# EAGLE design modem (EAGLE 6.6.0)
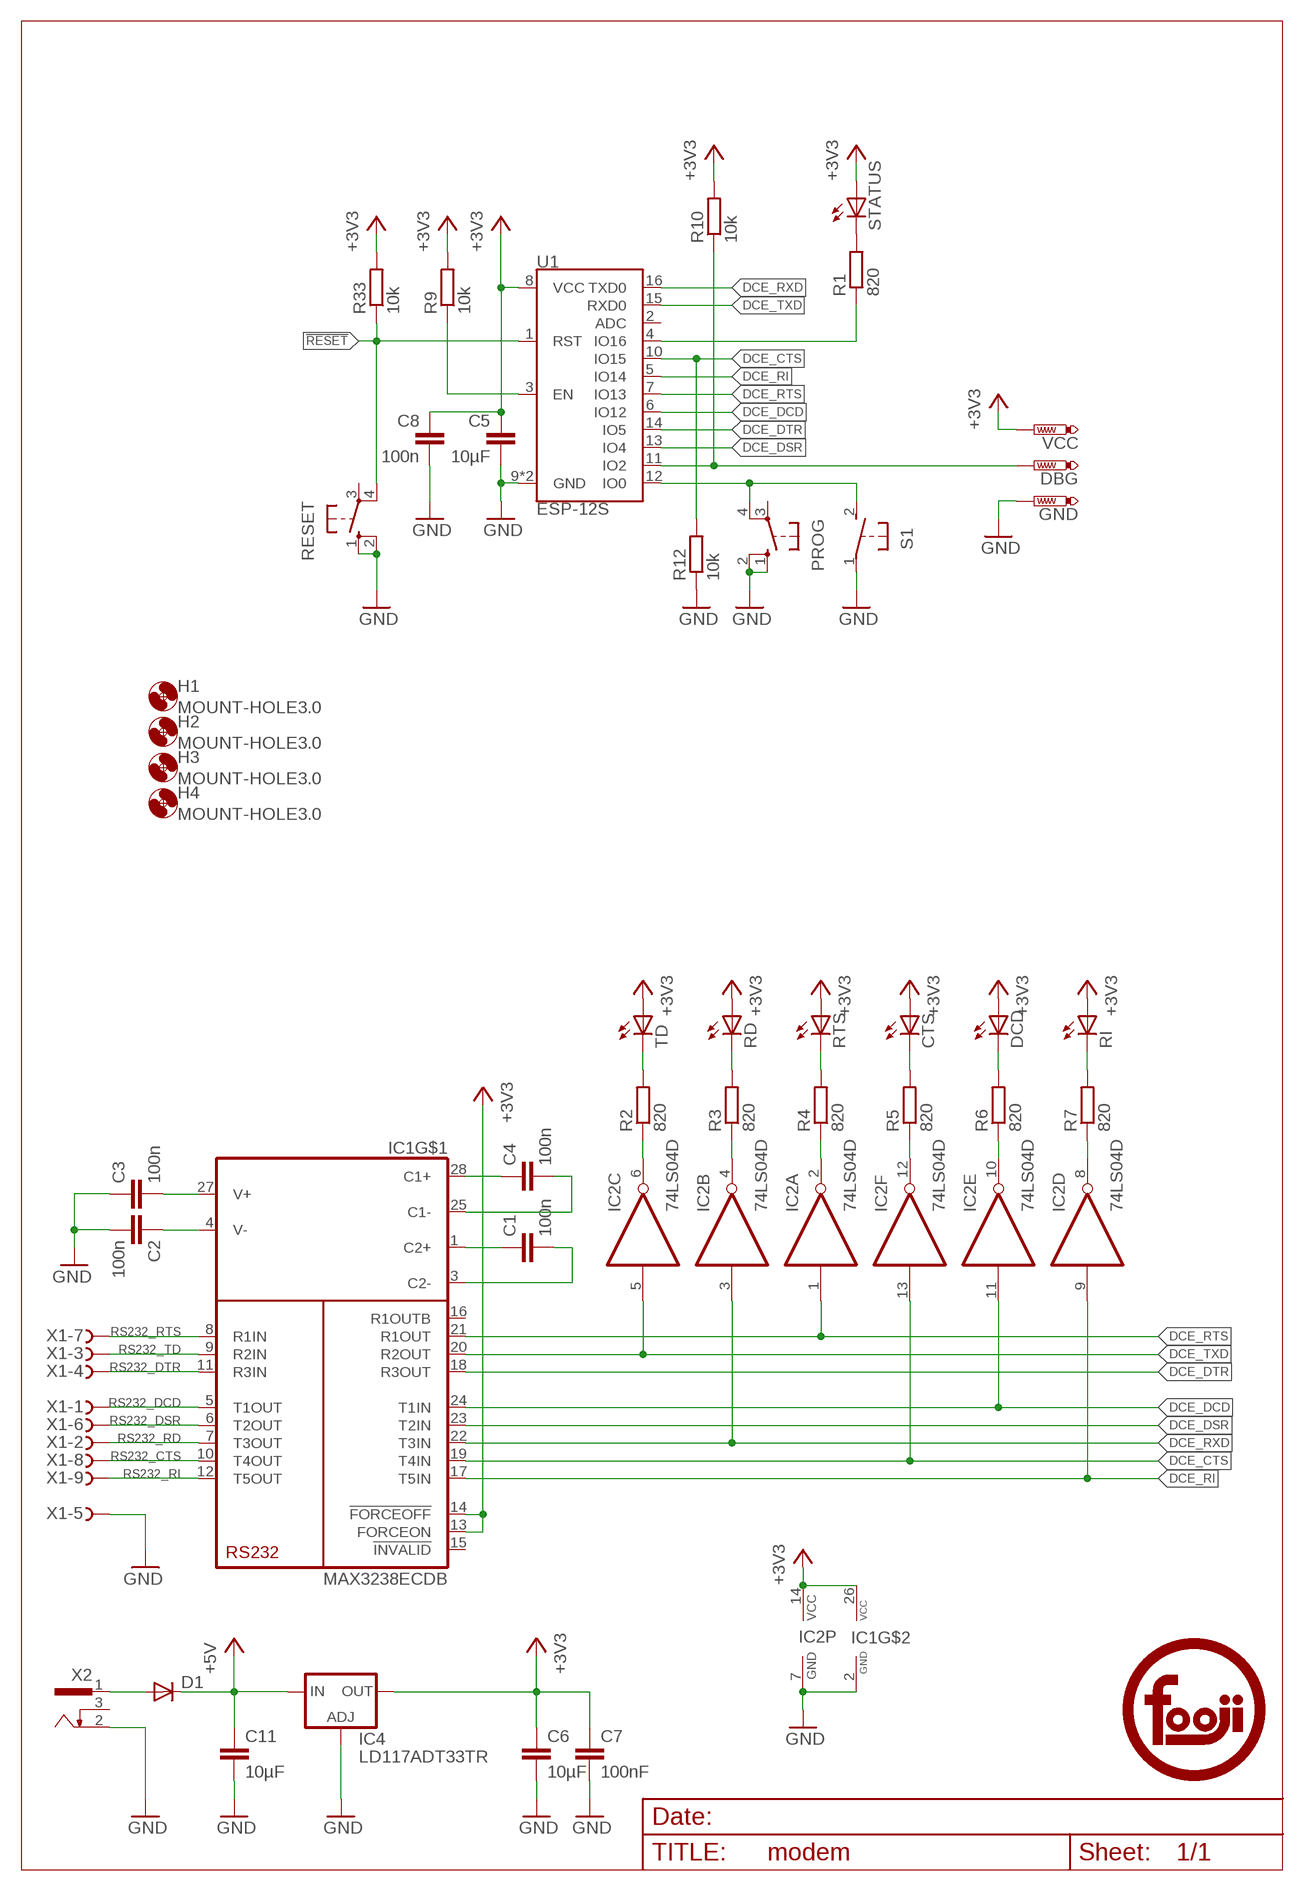
[diagram p0: schematic, sheet 1]

## Parts
C1  100n  C-EUC0805  [C0805]
C2  100n  C-EUC0805  [C0805]
C3  100n  C-EUC0805  [C0805]
C4  100n  C-EUC0805  [C0805]
C5  10µF  C-EUC0805  [C0805]
C6  10µF  C-EUC0805  [C0805]
C7  100nF  C-EUC0805  [C0805]
C8  100n  C-EUC0805  [C0805]
C11  10µF  C-EUC0805  [C0805]
CTS  LED5MM  [LED5MM]
D1  DIODE-SMB  [SMB]
DBG  PTR1PAD1-13  [P1-13]
DCD  LED5MM  [LED5MM]
GND  PTR1PAD1-13  [P1-13]
H1  MOUNT-HOLE3.0  [3,0]
H2  MOUNT-HOLE3.0  [3,0]
H3  MOUNT-HOLE3.0  [3,0]
H4  MOUNT-HOLE3.0  [3,0]
IC1  MAX3238ECDB  [SSOP28]
IC2  74LS04D  [SO14]
IC4  LD117ADT33TR  [DPACK]
PROG  10-XX  [B3F-10XX]
R1  820  R-EU_R0805  [R0805]
R2  820  R-EU_R0805  [R0805]
R3  820  R-EU_R0805  [R0805]
R4  820  R-EU_R0805  [R0805]
R5  820  R-EU_R0805  [R0805]
R6  820  R-EU_R0805  [R0805]
R7  820  R-EU_R0805  [R0805]
R9  10k  R-EU_R0805  [R0805]
R10  10k  R-EU_R0805  [R0805]
R12  10k  R-EU_R0805  [R0805]
R33  10k  R-EU_R0805  [R0805]
RD  LED5MM  [LED5MM]
RESET  10-XX  [B3F-10XX]
RI  LED5MM  [LED5MM]
RTS  LED5MM  [LED5MM]
S1  31-XX  [B3F-31XX]
STATUS  LED5MM  [LED5MM]
TD  LED5MM  [LED5MM]
U1  ESP-12S  [ESP-12S]
U$3  LOGOTOP_NOCIRCLE_TSTOP  [LOGO_TOP_NOCIRCLE_TSTOP]
VCC  PTR1PAD1-13  [P1-13]
X1  F09HPS  [F09HP]
X2  733980-62  [733980-62]

## Nets
!RESET: R33.1 RESET.4(P1) U1.1(RST)
+3V3: C5.1 C6.1 C7.1 C8.1 CTS.A DCD.A IC1.13(FORCEON) IC1.14(!FORCEOFF) IC1.26(VCC) IC2.14(P:VCC) IC4.4(OUT) R9.2 R10.2 R33.2 RD.A RI.A RTS.A STATUS.A TD.A U1.8(VCC) VCC.TP
+5V: C11.1 D1.C IC4.3(IN)
DCE_CTS: IC1.19(T4IN) IC2.13(F:I) R12.2 U1.10(IO15)
DCE_DCD: IC1.24(T1IN) IC2.11(E:I) U1.6(IO12)
DCE_DSR: IC1.23(T2IN) U1.13(IO4)
DCE_DTR: IC1.18(R3OUT) U1.14(IO5)
DCE_RI: IC1.17(T5IN) IC2.9(D:I) U1.5(IO14)
DCE_RTS: IC1.21(R1OUT) IC2.1(A:I) U1.7(IO13)
DCE_RXD: IC1.22(T3IN) IC2.3(B:I) U1.16(TXD0)
DCE_TXD: IC1.20(R2OUT) IC2.5(C:I) U1.15(RXD0)
DEBUG: DBG.TP R10.1 U1.11(IO2)
GND: C2.2 C3.1 C5.2 C6.2 C7.2 C8.2 C11.2 GND.TP IC1.2(GND) IC2.7(P:GND) IC4.1(ADJ) PROG.1(S) PROG.2(S1) R12.1 RESET.1(S) RESET.2(S1) S1.1(P) U1.9(GND) U1.P$1(GND) X1.5(-5:F) X2.2
N$1: R1.2 STATUS.K(C)
N$2: IC2.6(C:O) R2.1
N$3: R9.1 U1.3(EN)
N$4: D1.A X2.1
N$5: R2.2 TD.K(C)
N$6: R3.2 RD.K(C)
N$7: IC2.4(B:O) R3.1
N$8: IC2.2(A:O) R4.1
N$9: IC2.12(F:O) R5.1
N$10: CTS.K(C) R5.2
N$11: C2.1 IC1.4(V-)
N$12: C3.2 IC1.27(V+)
N$13: C1.1 IC1.1(C2+)
N$14: C1.2 IC1.3(C2-)
N$15: C4.2 IC1.25(C1-)
N$16: C4.1 IC1.28(C1+)
N$17: DCD.K(C) R6.2
N$18: R7.2 RI.K(C)
N$19: IC2.8(D:O) R7.1
N$20: IC2.10(E:O) R6.1
N$21: R4.2 RTS.K(C)
N$23: PROG.4(P1) S1.2(S) U1.12(IO0)
RS232_CTS: IC1.10(T4OUT) X1.8(-8:F)
RS232_DCD: IC1.5(T1OUT) X1.1(-1:F)
RS232_DSR: IC1.6(T2OUT) X1.6(-6:F)
RS232_DTR: IC1.11(R3IN) X1.4(-4:F)
RS232_RD: IC1.7(T3OUT) X1.2(-2:F)
RS232_RI: IC1.12(T5OUT) X1.9(-9:F)
RS232_RTS: IC1.8(R1IN) X1.7(-7:F)
RS232_TD: IC1.9(R2IN) X1.3(-3:F)
STATUS_A: R1.1 U1.4(IO16)
Unconnected: IC1.15(!INVALID) IC1.16(R1OUTB) PROG.3(P) RESET.3(P) U1.2(ADC) X1.G1(-G:G1) X1.G2(-G:G2) X2.3

## Library data of the parts
C1-C8 C11 = rcl:C-EU: CAPACITOR, European symbol
CTS DCD RD RI RTS STATUS TD = led:LED: LED OSRAM: - CHIPLED LG R971, LG N971, LY N971, LG Q971, LY Q971, LO R971, LY R971 LH N974, LH R974 LS Q976, LO Q976, LY Q976 LO Q996 - Hyper CHIPLED LW Q18S LB Q993, LB Q99A, LB R99A - SideLED LS A670, LO A670, LY A670, LG A670, LP A670 LB A673, LV A673, LT A673, LW A673 LH A674 LY A675 LS A676, LA A676, LO A676, LY A676, LW A676 LS A679, LY A679, LG A679 - Hyper Micro SIDELED® LS Y876, LA Y876, LO Y876, LY Y876 LT Y87S - SmartLED LW L88C, LW L88S LB L89C, LB L89S, LG L890 LS L89K, LO L89K, LY L89K LS L896, LA L896, LO L896, LY L896 - TOPLED LS T670, LO T670, LY T670, LG T670, LP T670 LSG T670, LSP T670, LSY T670, LOP T670, LYG T670 LG T671, LOG T671, LSG T671 LB T673, LV T673, LT T673, LW T673 LH T674 LS T676, LA T676, LO T676, LY T676, LB T676, LH T676, LSB T676, LW T676 LB T67C, LV T67C, LT T67C, LS T67K, LO T67K, LY T67K, LW E67C LS E67B, LA E67B, LO E67B, LY E67B, LB E67C, LV E67C, LT E67C LW T67C LS T679, LY T679, LG T679 LS T770, LO T770, LY T770, LG T770, LP T770 LB T773, LV T773, LT T773, LW T773 LH T774 LS E675, LA E675, LY E675, LS T675 LS T776, LA T776, LO T776, LY T776, LB T776 LHGB T686 LT T68C, LB T68C - Hyper Mini TOPLED® LB M676 - Mini TOPLED Santana® LG M470 LS M47K, LO M47K, LY M47K Source: http://www.osram.convergy.de LUXEON: - LUMILED® LXK2-PW12-R00, LXK2-PW12-S00, LXK2-PW14-U00, LXK2-PW14-V00 LXK2-PM12-R00, LXK2-PM12-S00, LXK2-PM14-U00 LXK2-PE12-Q00, LXK2-PE12-R00, LXK2-PE12-S00, LXK2-PE14-T00, LXK2-PE14-U00 LXK2-PB12-K00, LXK2-PB12-L00, LXK2-PB12-M00, LXK2-PB14-N00, LXK2-PB14-P00, LXK2-PB14-Q00 LXK2-PR12-L00, LXK2-PR12-M00, LXK2-PR14-Q00, LXK2-PR14-R00 LXK2-PD12-Q00, LXK2-PD12-R00, LXK2-PD12-S00 LXK2-PH12-R00, LXK2-PH12-S00 LXK2-PL12-P00, LXK2-PL12-Q00, LXK2-PL12-R00 Source: www.luxeon.com KINGBRIGHT: KA-3528ASYC Source: www.kingbright.com
D1 = diode:DIODE-: DIODE
DBG GND VCC = testpad:PTR1: TEST PIN
H1-H4 = holes:MOUNT-HOLE: MOUNTING HOLE with drill center marker
IC1 = modem:MAX3238E
IC2 = 74xx-eu:74*04: Hex INVERTER
IC4 = v-reg:LD117A?*: Low drop fixed and adjustable positive voltage regulators 1 A Source: http://www.st.com/stonline/products/literature/ds/7194/ld1117axx.pdf
PROG RESET = switch-omron:10-XX: OMRON SWITCH; MPN: B3F-1000; OC_FARNELL: 176432; OC_NEWARK: 36M3542
R1-R7 R9 R10 R12 R33 = rcl:R-EU_: RESISTOR, European symbol
S1 = switch-omron:31-XX: OMRON SWITCH; MPN: B3F-3100; OC_FARNELL: 959704; OC_NEWARK: 36M3582
U1 = modem:ESP-12S: AI-Thinker ESP-12S ESP-12S WiFi module is developed by AI-Thinker Co.,Ltd, core processor ESP8266 in smaller sizes of the module encapsulates Tensilica L106 integrates industry-leading ultra low power 32-bit MCU micro, with the 16-bit short mode, clock speed support 80 MHz, 160 MHz, supports the RTOS, integrated Wi-Fi MAC/BB/RF/PA/LNA, on-board antennas.; PROD_ID: IC-14115
U$3 = fooji:LOGO
X1 = con-subd:F09HPS: SUB-D; OC_FARNELL: unknown; OC_NEWARK: unknown
X2 = con-conrad:73398?: FEMALE PRINT CONNECTOR Niedervolt-Steckverbinder Distributor Conrad

## Board
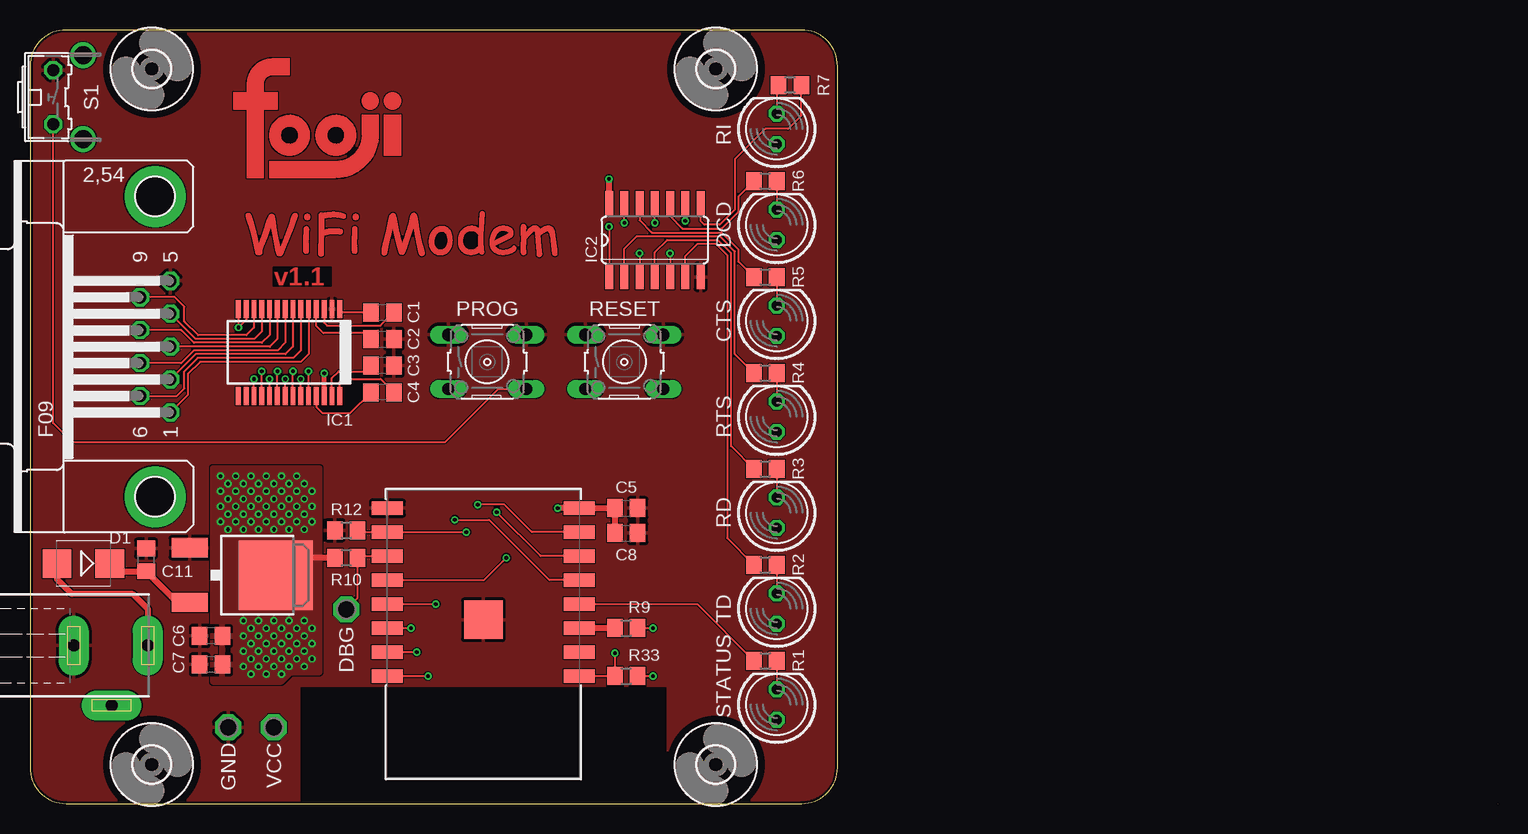
[diagram p1: board, top side]
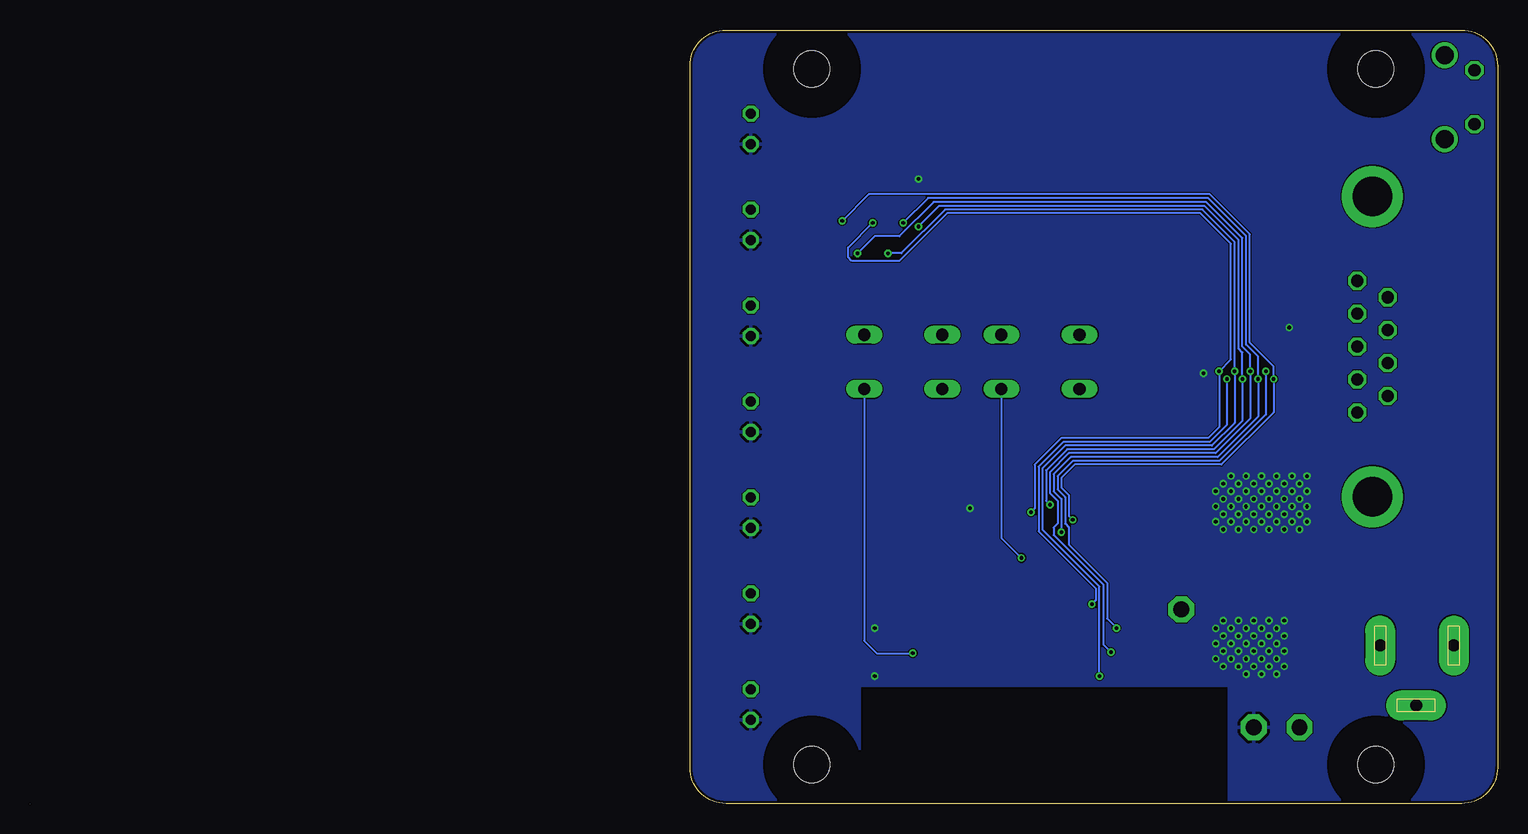
[diagram p2: board, bottom side, seen from below]

Size 122.3 x 64.5 mm. Coordinates in mm from the lower left corner, seen from the top.
Outline: 122.3,0 122.3,0
Outline: 0,61.5 0,3 arc90 3,0 64.3,0 arc90 67.3,3 67.3,61.5 arc90 64.3,64.5 3,64.5 arc90 0,61.5
Copper layers (1*16): Top 0.035mm / dielectric 1.5mm / Bottom 0.035mm
Design rules "aisler_2_layer *": minimum track width 6mil, minimum drill 0.3mm, track to track 0.1mm, track to pad 0.1mm, pad to pad 0.1mm, via to via 0.1mm, smd to smd 0.1mm, copper to edge 0.2mm, drill to drill 0.21mm, minimum pad ring 0.25mm, minimum via ring 0.15mm, stop-mask expansion 0mil, vias tented up to drill 0mil, thermal gap 10mil

### Footprints (pad centres in the part's own frame; a part is rotated, then mirrored left to right if it is on the bottom)
C0805 = smd 1.3 x 1.5: 1 -0.95,0; 2 0.95,0
LED5MM = drill 0.813 octagon: A -1.27,0; K 1.27,0
SMB = smd 2.4 x 2.4: A 2.2,0; C -2.2,0
P1-13 = drill 1.321 pad 2.159 octagon: TP 0,0
3,0 = hole 3: 0,0
SSOP28 = smd 0.4 x 1.5: 1 -4.225,-3.625; 2 -3.575,-3.625; 3 -2.925,-3.625; 4 -2.275,-3.625; 5 -1.625,-3.625; 6 -0.975,-3.625; 7 -0.325,-3.625; 8 0.325,-3.625; 9 0.975,-3.625; 10 1.625,-3.625; 11 2.275,-3.625; 12 2.925,-3.625; 13 3.575,-3.625; 14 4.225,-3.625; 15 4.225,3.625; 16 3.575,3.625; 17 2.925,3.625; 18 2.275,3.625; 19 1.625,3.625; 20 0.975,3.625; 21 0.325,3.625; 22 -0.325,3.625; 23 -0.975,3.625; 24 -1.625,3.625; 25 -2.275,3.625; 26 -2.925,3.625; 27 -3.575,3.625; 28 -4.225,3.625
SO14 = smd 0.66 x 2.032: 1 -3.81,-3.073; 2 -2.54,-3.073; 3 -1.27,-3.073; 4 0,-3.073; 5 1.27,-3.073; 6 2.54,-3.073; 7 3.81,-3.073; 8 3.81,3.073; 9 2.54,3.073; 10 1.27,3.073; 11 0,3.073; 12 -1.27,3.073; 13 -2.54,3.073; 14 -3.81,3.073
DPACK = smd 1.6 x 3: 1 -2.28,-4.8; 3 2.28,-4.8 | smd 5.8 x 6.2: 4 0,2.38
B3F-10XX = drill 1.016 long: 1 -3.251,2.261; 2 3.251,2.261; 3 -3.251,-2.261; 4 3.251,-2.261
R0805 = smd 1.3 x 1.5: 1 -0.95,0; 2 0.95,0
B3F-31XX = drill 1.016 octagon: 1 -2.261,-1.245; 2 2.261,-1.245 | drill 1.499 pad 2.159: 3 -3.505,1.245; 4 3.505,1.245
ESP-12S = smd 2.6 x 1.1: 1 -8,3.5; 2 -8,1.5; 3 -8,-0.5; 4 -8,-2.5; 5 -8,-4.5; 6 -8,-6.5; 7 -8,-8.5; 8 -8,-10.5; 9 8,-10.5; 10 8,-8.5; 11 8,-6.5; 12 8,-4.5; 13 8,-2.5; 14 8,-0.5; 15 8,1.5; 16 8,3.5 | smd 3.2 x 3.2: P$1 0,-1.2
F09HP = drill 1.016 octagon: 1 -5.486,-1.27; 2 -2.743,-1.27; 3 0,-1.27; 4 2.743,-1.27; 5 5.486,-1.27; 6 -4.115,1.27; 7 -1.372,1.27; 8 1.372,1.27; 9 4.115,1.27 | drill 3.302 pad 5.08: G1 -12.522,0; G2 12.522,0
733980-62 = drill 1 pad 2.5 long: 1 0,8.57; 2 0,2.42; 3 5,5.57

### Placement (x,y rotation side)
C1  29.37,40.96 0 top
C2  29.37,38.73 0 top
C3  29.37,36.51 180 top
C4  29.37,34.29 180 top
C5  49.69,24.63 0 top
C6  15.08,13.97 180 top
C7  15.08,11.59 180 top
C8  49.69,22.54 0 top
C11  9.68,20.32 90 top
CTS  62.23,40.26 90 top
D1  4.45,20 180 top
DBG  26.35,16.19 180 top
DCD  62.23,48.26 90 top
GND  16.51,6.35 0 top
H1  57.15,61.25 0 top
H2  10.15,61.25 0 top
H3  10.15,3.25 0 top
H4  57.15,3.25 0 top
IC1  21.59,37.62 180 top
IC2  52.07,46.99 0 top
IC4  18.1,19.05 270 top
PROG  38.1,36.83 0 top
R1  61.28,11.91 0 top
R2  61.27,19.91 0 top
R3  61.27,27.91 0 top
R4  61.27,35.91 0 top
R5  61.27,43.91 0 top
R6  61.27,51.91 0 top
R7  63.34,59.91 180 top
R9  49.69,14.63 0 top
R10  26.35,20.47 180 top
R12  26.35,22.79 0 top
R33  49.69,10.63 0 top
RD  62.23,24.25 90 top
RESET  49.53,36.83 0 top
RI  62.23,56.26 90 top
RTS  62.23,32.26 90 top
S1  3.17,58.9 270 top
STATUS  62.23,8.26 90 top
TD  62.23,16.25 90 top
U1  37.78,14.13 180 top
U$3  23.92,57.15 0 top
VCC  20.32,6.35 0 top
X1  10.43,38.1 90 top
X2  1.22,13.18 270 top

### Tracks (layer width: path | path; a pad name or v marks a point on that pad's centre or on a via)
!RESET  (via drill 0.3)
  Top 0.152: U1.1 R33.1 v48.74,12.54
  Bottom 0.152: v48.74,12.54 51.75,12.54 52.78,13.57 RESET.4
+3V3  (via drill 0.3)
  Top 0.152: R33.2 v51.91,10.63 | R9.2 v51.91,14.63 | IC1.14 v17.36,39.69 18.02,40.34 IC1.13
  Top 0.406: IC1.26 v24.52,35.88
  Top 0.508: C8.1 C5.1 U1.8 v43.97,24.63 | 21.59,20.32 21.43,20.32 | R10.2 22.86,20.47 | IC2.14 v48.26,52.07
  other vias: 15.88,27.3 17.14,27.3 18.41,27.3 19.68,27.3 20.95,27.3 22.23,27.3 22.86,26.67 21.59,26.67 20.32,26.67 19.05,26.67 17.78,26.67 16.51,26.67 15.88,26.04 16.51,25.4 17.14,26.04 18.41,26.04 17.78,25.4 18.41,24.77 19.05,25.4 19.68,26.04 20.95,26.04 20.32,25.4 21.59,25.4 22.23,26.04 22.86,25.4 23.5,26.04 23.5,24.77 22.23,24.77 20.95,24.77 19.68,24.77 17.14,24.77 15.88,24.77 16.51,24.13 17.78,24.13 19.05,24.13 20.32,24.13 21.59,24.13 22.86,24.13 23.5,23.5 22.23,23.5 20.95,23.5 19.68,23.5 18.41,23.5 17.14,23.5 15.88,23.5 16.51,22.86 17.78,22.86 19.05,22.86 20.32,22.86 21.59,22.86 22.86,22.86 17.78,15.24 19.05,15.24 20.32,15.24 21.59,15.24 22.86,15.24 23.5,14.61 22.86,13.97 22.23,14.61 20.95,14.61 19.68,14.61 18.41,14.61 17.78,13.97 18.41,13.34 19.05,13.97 20.32,13.97 21.59,13.97 22.23,13.34 20.95,13.34 19.68,13.34 17.78,12.7 19.05,12.7 20.32,12.7 21.59,12.7 22.86,12.7 23.5,13.34 23.5,12.06 22.23,12.06 20.95,12.06 19.68,12.06 18.41,12.06 17.78,11.43 19.05,11.43 20.32,11.43 21.59,11.43 22.86,11.43 20.95,10.79 19.68,10.79 18.41,10.79
  pour Top (no thermals): 15.24,27.94 15.24,15.24 17.78,15.24 17.78,10.16 20.95,10.16 21.75,10.95 24.13,10.95 24.13,27.94
  pour Bottom: 0,64.77 67.31,64.77 67.31,0 0,0
  pour Top: 15.24,15.24 15.24,10.16 17.78,10.16 17.78,15.24
+5V
  Top 0.406: 13.02,16.8 IC4.3
  Top 0.508: D1.C 6.64,19.37 C11.1 12.25,16.8 13.02,16.8
DCE_CTS  (via drill 0.3)
  Top 0.152: R12.2 27.3,22.7 27.3,22.63 U1.10 v36.35,22.63 | IC1.19 v19.96,35.4 | v49.53,48.42 IC2.13
  Bottom 0.152: v36.35,22.63 36.35,25.4 36.99,26.04 36.99,27.46 35.56,28.89 23.34,28.89 19.96,32.26 v19.96,35.4 19.96,37.27 20.95,38.26 20.95,47.31 24.13,50.48 47.47,50.48 v49.53,48.42
DCE_DCD  (via drill 0.3)
  Top 0.152: IC1.24 v23.21,36.04 | U1.6 42.55,20.63 v38.89,24.29 | v52.07,48.42 IC2.11
  Bottom 0.152: v38.89,24.29 38.58,24.61 38.58,28.26 36.35,30.48 24.13,30.48 23.21,31.39 v23.21,36.04 22.23,37.03 22.23,46.67 24.77,49.21 45.88,49.21 49.85,45.24 53.82,45.24 54.13,45.56 54.13,46.35 v52.07,48.42
DCE_DSR  (via drill 0.3)
  Top 0.152: IC1.23 v22.57,35.4 | U1.13 v33.81,16.63
  Bottom 0.152: v22.57,35.4 22.57,31.57 23.97,30.16 36.2,30.16 38.26,28.1 38.26,22.7 33.5,17.94 33.5,16.95 v33.81,16.63
DCE_DTR  (via drill 0.3)
  Top 0.152: IC1.18 v19.32,36.04 | U1.14 v31.75,14.63
  Bottom 0.152: v19.32,36.04 19.32,32.44 23.18,28.57 35.4,28.57 36.67,27.3 36.67,26.19 36.04,25.56 36.04,23.34 35.72,23.02 35.72,21.59 32.54,18.41 32.54,15.42 v31.75,14.63
DCE_RI  (via drill 0.3)
  Top 0.152: IC1.17 v18.66,35.4 | U1.5 43.28,18.63 38.26,23.65 v35.4,23.65 | v54.61,48.58 IC2.9
  Bottom 0.152: v35.4,23.65 35.72,23.97 35.72,25.72 36.35,26.35 36.35,27.15 35.24,28.26 23.02,28.26 18.66,32.61 v18.66,35.4 18.66,36.45 20.64,38.42 20.64,47.47 23.97,50.8 52.39,50.8 v54.61,48.58
DCE_RTS  (via drill 0.3)
  Top 0.152: IC1.21 v21.27,35.4 | U1.7 41.82,22.63 39.53,24.92 v37.31,24.92 | v48.26,48.1 IC2.1
  Bottom 0.152: v37.31,24.92 37.62,25.24 37.62,27.78 35.88,29.53 23.65,29.53 21.27,31.92 v21.27,35.4 21.27,37.62 21.59,37.94 21.59,46.99 24.45,49.85 46.51,49.85 v48.26,48.1
DCE_RXD  (via drill 0.3)
  Top 0.152: IC1.22 v21.91,36.04 | U1.16 v33.18,10.63 | v50.8,45.88 IC2.3
  Bottom 0.152: v33.18,10.63 33.18,18.1 37.94,22.86 37.94,27.94 36.04,29.84 23.81,29.84 21.91,31.74 v21.91,36.04 21.91,38.74 21.91,39.05 21.91,46.83 24.61,49.53 46.04,49.53 49.69,45.88 v50.8,45.88
DCE_TXD  (via drill 0.3)
  Top 0.152: IC1.20 v20.61,36.04 | U1.15 v32.23,12.63 | v53.34,45.88 IC2.5
  Bottom 0.152: v32.23,12.63 32.86,13.26 32.86,18.26 36.99,22.38 36.99,23.02 36.67,23.34 36.67,25.24 37.31,25.88 37.31,27.62 35.72,29.21 23.5,29.21 20.61,32.09 v20.61,36.04 20.61,37.44 21.27,38.1 21.27,47.15 24.29,50.16 46.99,50.16 49.85,47.31 51.91,47.31 v53.34,45.88
DEBUG
  Top 0.152: U1.11 27.3,20.63 R10.1 27.3,17.14 DBG.TP
GND
  pour Top (rank 5): 0,64.77 67.31,64.77 67.31,0 53.18,0 21.91,0 0,0
N$1
  Top 0.152: R1.2 STATUS.K
N$2
  Top 0.152: IC2.6 54.61,45.66 55.63,46.67 57.15,46.67 58.1,45.72 58.1,22.13 R2.1
N$3
  Top 0.508: U1.3 R9.1
N$4
  Top 0.508: X2.1 9.84,16.2 8.57,17.46 3.49,17.46 2.25,18.71 D1.A
N$5
  Top 0.152: R2.2 TD.K
N$6
  Top 0.152: R3.2 RD.K
N$7
  Top 0.152: IC2.4 52.07,45.97 53.09,46.99 57.31,46.99 58.42,45.88 58.42,29.81 R3.1
N$8
  Top 0.152: IC2.2 49.53,46.29 50.55,47.31 57.47,47.31 58.74,46.04 58.74,37.49 R4.1
N$9
  Top 0.152: IC2.12 50.8,48.64 51.82,47.62 57.63,47.62 59.05,46.2 59.05,45.18 R5.1
N$10
  Top 0.152: R5.2 CTS.K
N$11
  Top 0.152: C2.1 27.94,39.21 24.45,39.21 23.86,39.79 IC1.4
N$12
  Top 0.152: IC1.27 25.16,35.48 25.72,36.04 27.94,36.04 C3.2
N$13
  Top 0.152: C1.1 25.82,40.96 IC1.1
N$14
  Top 0.152: IC1.3 24.52,40.1 24.77,39.85 29.21,39.85 C1.2
N$15
  Top 0.152: IC1.25 23.86,33.05 24.37,32.55 26.68,32.55 C4.2
N$16
  Top 0.152: IC1.28 25.82,35.18 26.04,35.4 29.21,35.4 30,34.61 C4.1
N$17
  Top 0.152: R6.2 DCD.K
N$18
  Top 0.152: R7.2 62.23,59.9 RI.K
N$19
  Top 0.152: IC2.8 55.88,48.58 56.2,48.26 57.47,48.26 58.74,49.53 58.74,53.72 61.28,56.26 63.18,56.26 64.29,57.36 R7.1
N$20
  Top 0.152: IC2.10 53.34,48.96 54.36,47.94 57.63,47.94 59.05,49.37 59.05,50.64 R6.1
N$21
  Top 0.152: R4.2 RTS.K
N$23  (via drill 0.3)
  Top 0.152: U1.12 37.84,18.63 v39.69,20.48 | PROG.4 39.01,34.57 34.61,30.16 3.49,30.16 1.93,31.73 S1.2
  Bottom 0.152: PROG.4 41.35,22.14 v39.69,20.48
RS232_CTS
  Top 0.152: IC1.10 19.96,39.05 19.33,38.42 13.65,38.42 12.6,39.47 X1.8
RS232_DCD
  Top 0.152: IC1.5 23.21,37.47 22.58,36.83 14.17,36.83 13.18,35.84 13.18,34.09 X1.1
RS232_DSR
  Top 0.152: IC1.6 22.57,37.78 21.93,37.15 13.97,37.15 12.86,36.04 12.86,34.61 12.24,33.98 X1.6
RS232_DTR
  Top 0.152: IC1.11 19.32,39.37 18.68,38.73 13.81,38.73 X1.4
RS232_RD
  Top 0.152: IC1.7 21.91,38.1 21.28,37.47 13.81,37.47 X1.2
RS232_RI
  Top 0.152: IC1.12 18.66,39.69 18.03,39.05 14.01,39.05 12.86,40.2 12.86,41.43 12.08,42.22 X1.9
RS232_RTS
  Top 0.152: IC1.8 21.27,38.42 20.63,37.78 13.65,37.78 12.6,36.73 X1.7
RS232_TD
  Top 0.152: IC1.9 20.61,38.73 19.98,38.1 X1.3
STATUS_A
  Top 0.152: U1.4 55.61,16.63 R1.1
(copper drawn outside any net)
  shapes: Top area x5146

### Text on the board
Top: v1.1
tStop: v1.1
Document: Enclosure Bopla UNIMAS U85